# Altium schematic sheet MCU.SchDoc
size A4; Date: 07.06.2021; Author: Mateusz Mróz; CompanyName: AGH; DocumentNumber: 2; SheetNumber: 2; SheetTotal: 6
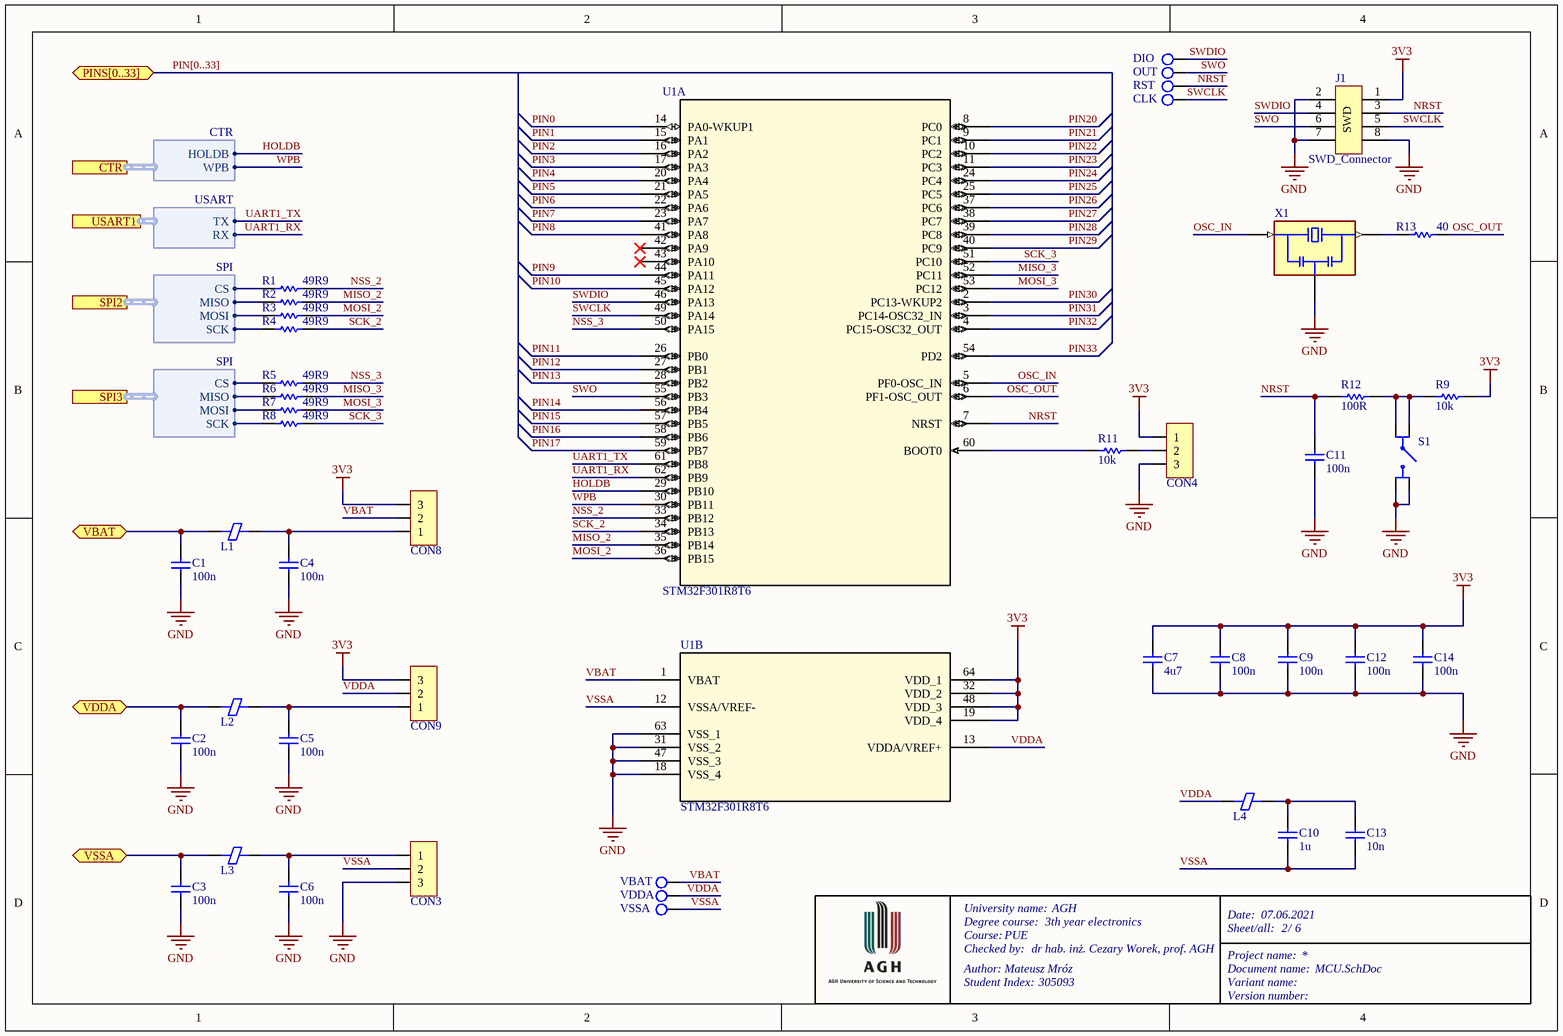
[diagram p0: MCU.SchDoc]

## Parts
C1  100n  [Cap_0402_MD_outline]
C2  100n  [Cap_0402_MD_outline]
C3  100n  [Cap_0402_MD_outline]
C4  100n  [Cap_0402_MD_outline]
C5  100n  [Cap_0402_MD_outline]
C6  100n  [Cap_0402_MD_outline]
C7  4u7  [Cap_0805_MD_outline]
C8  100n  [Cap_0603_MD_outline]
C9  100n  [Cap_0603_MD_outline]
C10  1u  [Cap_0805_MD_outline]
C11  100n  [Cap_0603_MD_outline]
C12  100n  [Cap_0603_MD_outline]
C13  10n  [Cap_0603_MD_outline]
C14  100n  [Cap_0603_MD_outline]
CON3  Header 3  [HDR_1X3_2.54]  (value not drawn)
CON4  Header 3  [HDR_1X3_2.54]  (value not drawn)
CON8  Header 3  [HDR_1X3_2.54]  (value not drawn)
CON9  Header 3  [HDR_1X3_2.54]  (value not drawn)
J1  SWD_Connector  [MicroLock_6p_vert]
L1  (no value)  [Bead_0402_MD]
L2  (no value)  [Bead_0402_MD]
L3  (no value)  [Bead_0402_MD]
L4  (no value)  [Bead_0402_MD]
R1  49R9  [Res_0603_MD_outline]
R2  49R9  [Res_0603_MD_outline]
R3  49R9  [Res_0603_MD_outline]
R4  49R9  [Res_0603_MD_outline]
R5  49R9  [Res_0603_MD]
R6  49R9  [Res_0603_MD]
R7  49R9  [Res_0603_MD]
R8  49R9  [Res_0603_MD]
R9  10k  [Res_0603_MD_outline]
R11  10k  [Res_0603_MD_outline]
R12  100R  [Res_0603_MD_outline]
R13  40  [Res_0603_MD_outline]
S1  Switch  [EVPBB0AAB000]  (value not drawn)
TP1  VBAT  [TP_SQ40]  (no BOM)
TP2  VDDA  [TP_SQ40]  (no BOM)
TP3  VSSA  [TP_SQ40]  (no BOM)
TP4  DIO  [TP_SQ25x40]  (no BOM)
TP5  OUT  [TP_SQ25x40]  (no BOM)
TP6  RST  [TP_SQ25x40]  (no BOM)
TP7  CLK  [TP_SQ25x40]  (no BOM)
U1  STM32F301R8T6  [LQFP64-10x10mm]  (parts A,B of 2)
X1  Resonator  [OSC_CSTNE8M00GH5L000R0]  (value not drawn)

## Ports
CTR (harness CTR), PINS[0..33] (bidir), SPI2 (harness SPI), SPI3 (harness SPI), USART1 (harness USART), VBAT (bidir), VDDA (bidir), VSSA (bidir)

## Harnesses
USART: TX, RX
SPI: CS, MISO, MOSI, SCK
CTR: HOLDB, WPB

## Nets
3V3: C7.2 C8.2 C9.2 C12.2 C14.2 CON4.1 CON8.3 CON9.3 J1.1 R9.2 U1.19(VDD_4) U1.32(VDD_2) U1.48(VDD_3) U1.64(VDD_1)
GND: C1.2 C2.2 C3.2 C4.2 C5.2 C6.2 C7.1 C8.1 C9.1 C11.1 C12.1 C14.1 CON3.3 CON4.3 J1.2 J1.7 J1.8 S1.A1(NO_1) S1.A2(NO_2) U1.18(VSS_4) U1.31(VSS_2) U1.47(VSS_3) U1.63(VSS_1) X1.2(GND)
HOLDB: U1.29(PB10) ; port CTR.HOLDB
MISO_2: R2.2 U1.35(PB14)
MISO_3: R6.2 U1.52(PC11)
MOSI_2: R3.2 U1.36(PB15)
MOSI_3: R7.2 U1.53(PC12)
NRST: C11.2 J1.3 R12.2 TP6.1 U1.7(NRST)
NSS_2: R1.2 U1.33(PB12)
NSS_3: R5.2 U1.50(PA15)
OSC_IN: U1.5(PF0-OSC_IN) X1.1(IN)
OSC_OUT: R13.2 U1.6(PF1-OSC_OUT)
PIN0: U1.14(PA0-WKUP1)
PIN1: U1.15(PA1)
PIN2: U1.16(PA2)
PIN3: U1.17(PA3)
PIN4: U1.20(PA4)
PIN5: U1.21(PA5)
PIN6: U1.22(PA6)
PIN7: U1.23(PA7)
PIN8: U1.41(PA8)
PIN9: U1.44(PA11)
PIN10: U1.45(PA12)
PIN11: U1.26(PB0)
PIN12: U1.27(PB1)
PIN13: U1.28(PB2)
PIN14: U1.56(PB4)
PIN15: U1.57(PB5)
PIN16: U1.58(PB6)
PIN17: U1.59(PB7)
PIN20: U1.8(PC0)
PIN21: U1.9(PC1)
PIN22: U1.10(PC2)
PIN23: U1.11(PC3)
PIN24: U1.24(PC4)
PIN25: U1.25(PC5)
PIN26: U1.37(PC6)
PIN27: U1.38(PC7)
PIN28: U1.39(PC8)
PIN29: U1.40(PC9)
PIN30: U1.2(PC13-WKUP2)
PIN31: U1.3(PC14-OSC32_IN)
PIN32: U1.4(PC15-OSC32_OUT)
PIN33: U1.54(PD2)
SCK_2: R4.2 U1.34(PB13)
SCK_3: R8.2 U1.51(PC10)
SWCLK: J1.5 TP7.1 U1.49(PA14)
SWDIO: J1.4 TP4.1 U1.46(PA13)
SWO: J1.6 TP5.1 U1.55(PB3)
UART1_RX: U1.62(PB9) ; port USART1.RX
UART1_TX: U1.61(PB8) ; port USART1.TX
VBAT: CON8.2 TP1.1 U1.1(VBAT)
VBAT: C1.1 L1.1 ; port VBAT  [a separate net that carries the same name]
VDDA: CON9.2 L4.1 TP2.1 U1.13(VDDA/VREF+)
VDDA: C2.1 L2.1 ; port VDDA  [a separate net that carries the same name]
VSSA: C10.1 C13.1 CON3.2 TP3.1 U1.12(VSSA/VREF-)
VSSA: C3.1 L3.1 ; port VSSA  [a separate net that carries the same name]
WPB: U1.30(PB11) ; port CTR.WPB
NetC4_1: C4.1 CON8.1 L1.2
NetC5_1: C5.1 CON9.1 L2.2
NetC6_1: C6.1 CON3.1 L3.2
NetC10_2: C10.2 C13.2 L4.2
NetCON4_2: CON4.2 R11.1
NetR1_1: R1.1 ; port SPI2.CS
NetR2_1: R2.1 ; port SPI2.MISO
NetR3_1: R3.1 ; port SPI2.MOSI
NetR4_1: R4.1 ; port SPI2.SCK
NetR5_1: R5.1 ; port SPI3.CS
NetR6_1: R6.1 ; port SPI3.MISO
NetR7_1: R7.1 ; port SPI3.MOSI
NetR8_1: R8.1 ; port SPI3.SCK
NetR9_1: R9.1 R12.1 S1.B1(COM_1) S1.B2(COM_2)
NetR11_2: R11.2 U1.60(BOOT0)
NetR13_1: R13.1 X1.3(OUT)

Not connected (* = marked no-connect by the designer): U1 42(PA9)* 43(PA10)*

## Buses and harness runs
bus PIN[0..33] = port PINS[0..33]

## Notes on the sheet
- University name:
- Degree course:
- 3th year electronics
- Date:
- Author:
- Student Index:
- Course:
- Checked by:
- PUE
- dr hab. inż. Cezary Worek, prof. AGH
- 305093
- Project name:
- Document name:
- Variant name:
- Sheet/all:
- /
- Version number:
- (in symbol SWD_Connector) SWD

## Library data of the parts
C1-C6 = Capacitor: MPN: GRM155R71H103MA88; Value: 100n; Package: 0402
C7 = Capacitor: MPN: GRM21BR71C475ME51; Value: 4u7; Package: 0805
C8 C9 C11 C12 C14 = Capacitor: MPN: GRM188R72A104KA35; Value: 100n; Package: 0603
C10 = Capacitor: MPN: GRM219R7YA105KA12; Value: 1u; Package: 0805
C13 = Capacitor: MPN: GRM188R72A103KA01; Value: 10n; Package: 0603
CON3 CON4 CON8 CON9 = Header 3: Header, 3-Pin; MPN: G800LR305018EU
J1 = SWD_Connector: Connector; MPN: 5055680671
L1-L4 = Bead: Ferrite bead; MPN: BLM15PX601SN1; Package: 0402
R1-R8 = Resistor: MPN: CRCW060349R9FKEA; Value: 49R9; Package: 0603
R9 R11 = Resistor: MPN: CRCW060310K0FKEAC; Value: 10k; Package: 0603
R12 = Resistor: MPN: CRCW0603100RFKEAHP; Value: 100R; Package: 0603
R13 = Resistor: MPN: CRCW060340R2FKEA; Value: 40; Package: 0603
S1 = EVP-BB0AAB000: MPN: EVP-BB0AAB000
TP1-TP7 = TestPoint: Test point; HelpURL: *; MPN: *
  TP1: Value: VBAT
  TP2: Value: VDDA
  TP3: Value: VSSA
  TP4: Value: DIO
  TP5: Value: OUT
  TP6: Value: RST
  TP7: Value: CLK
U1 = STM32F301R8T6: MCU LQFP64; Vendor: STMicroelectronics; Built_By: EMA_UL_Team; SourceLibrary: Updates_to_database_2020-10-19; Copyright: Copyright (C) 2018 Accelerated Designs. All rights reserved; RefDes: RefDes; Type: DEV; MPN: STM32F301R8T6
X1 = CSTNE8M00GH5L000R0_1: 8MHz Ceramic Resonator; MF: Murata Electronics; Value: 8MHz; MPN: CSTNE8M00GH5L000R0